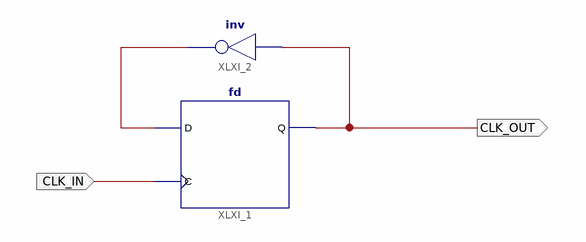
[diagram p0: schematic sheet 1]
// Xilinx ISE schematic Div_2.sch (spartan6) as structural Verilog: 2 symbols, 2 ports
module Div_2 (
  input  CLK_IN,
  output CLK_OUT
);

  wire XLXN_1;

  fd XLXI_1 (.C(CLK_IN), .D(XLXN_1), .Q(CLK_OUT));
  not XLXI_2 (XLXN_1, CLK_OUT);
endmodule
